# EAGLE design moisture_meter (EAGLE 6.3)
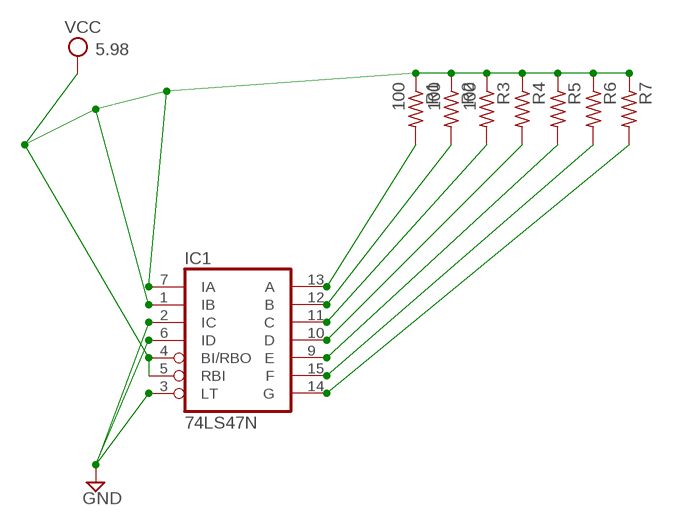
[diagram p0: schematic, sheet 1]

## Parts
IC1  74LS47N  [DIL16]
R1  100  R-US_0207/10  [0207/10]
R2  100  R-US_0207/10  [0207/10]
R3  100  R-US_0207/10  [0207/10]
R4  R-US_0207/10  [0207/10]
R5  R-US_0207/10  [0207/10]
R6  R-US_0207/10  [0207/10]
R7  R-US_0207/10  [0207/10]

## Nets
GND: IC1.2(IC) IC1.3(LT) IC1.6(ID)
N$8: IC1.13(A) R1.2
N$9: IC1.12(B) R2.2
N$10: IC1.11(C) R3.2
N$11: IC1.10(D) R4.2
N$12: IC1.9(E) R5.2
N$13: IC1.15(F) R6.2
N$14: IC1.14(G) R7.2
VCC: IC1.1(IB) IC1.4(BI/RBO) IC1.5(RBI) IC1.7(IA) R1.1 R2.1 R3.1 R4.1 R5.1 R6.1 R7.1

## Power pins joined to a net without a drawn wire
GND: IC1.8(GND)
VCC: IC1.16(VCC)

## Library data of the parts
IC1 = 74xx-eu:74*47: BCD to seven segment DECODER/DRIVER Source: http://www.ee.washington.edu/stores/DataSheets/74ls/74ls47.pdf
R1-R7 = resistor:R-US_: RESISTOR, American symbol

## Board
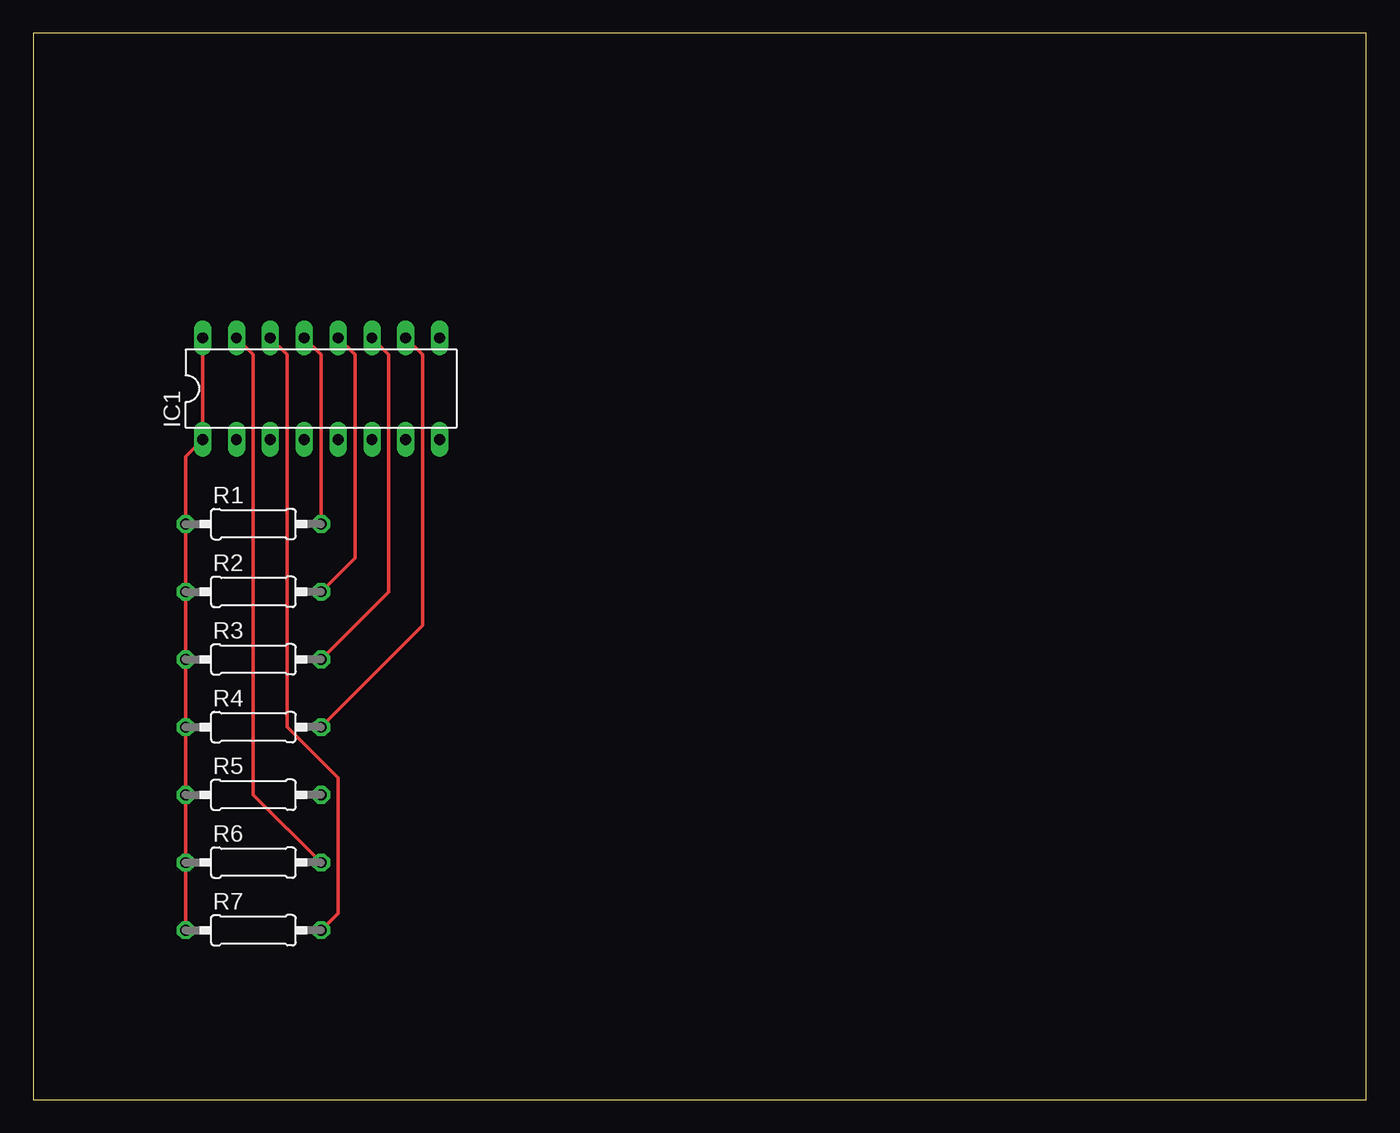
[diagram p1: board, top side]
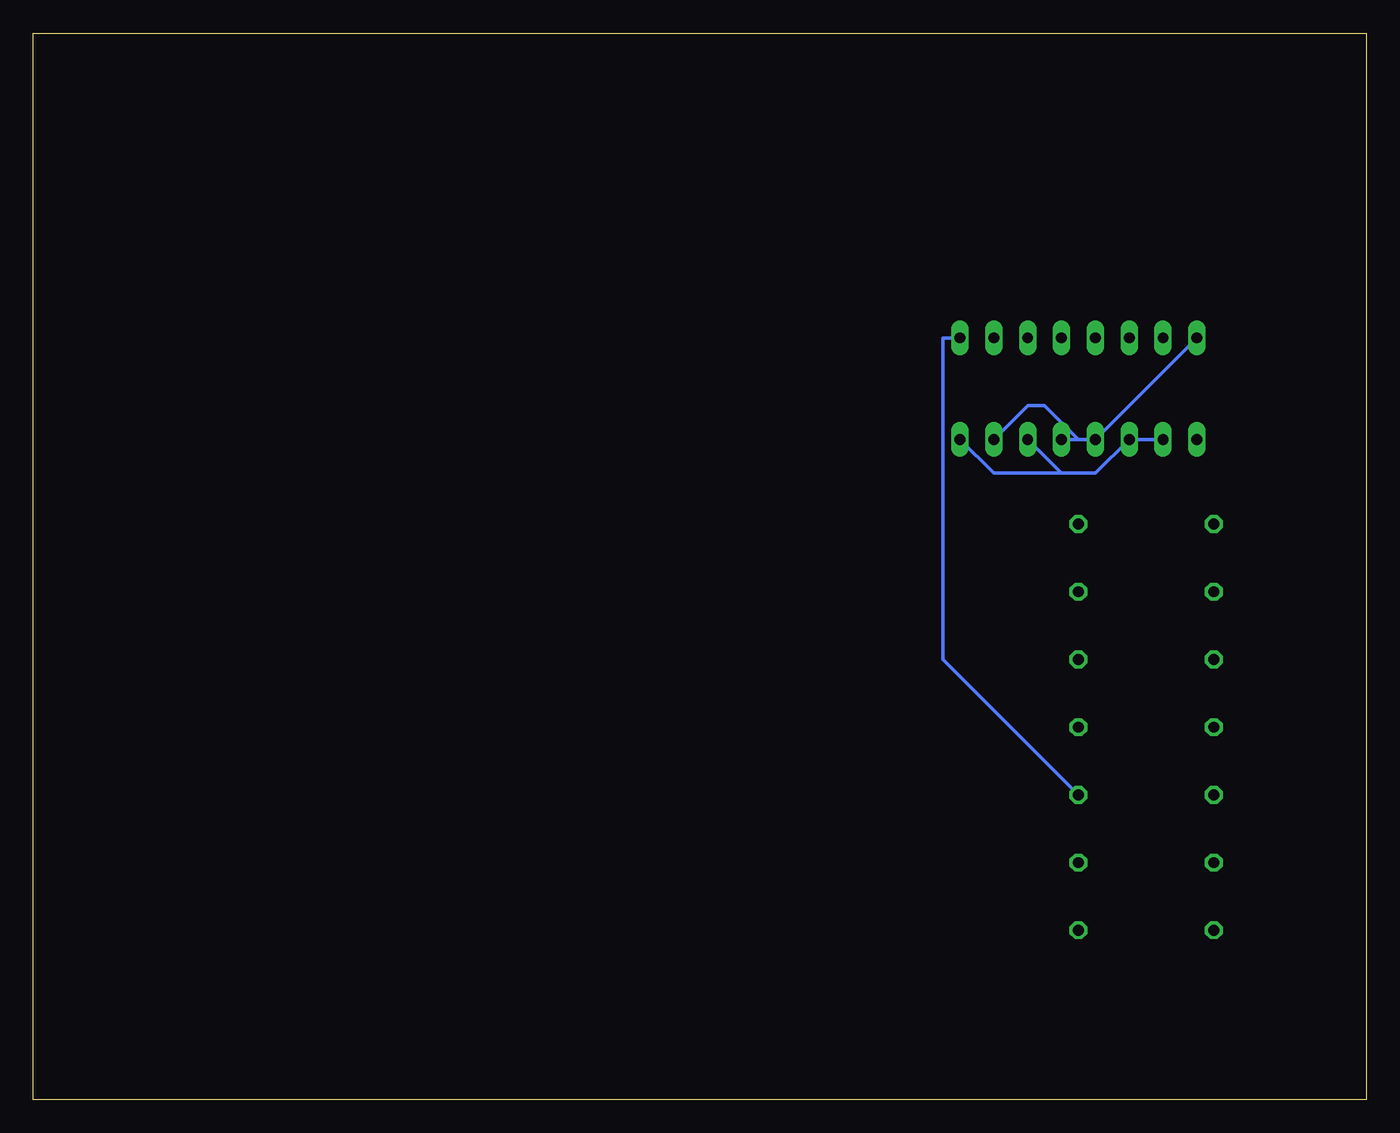
[diagram p2: board, bottom side, seen from below]

Size 100 x 80 mm. Coordinates in mm from the lower left corner, seen from the top.
Outline: 0,0 100,0 100,80 0,80 0,0
Copper layers (1*16): Top 0.035mm / dielectric 1.5mm / Bottom 0.035mm
Design rules "default": minimum track width 10mil, minimum drill 24mil, track to track 8mil, track to pad 8mil, pad to pad 8mil, via to via 8mil, smd to smd 8mil, copper to edge 40mil, drill to drill 8mil, minimum pad ring 10mil, minimum via ring 8mil, stop-mask expansion 4mil, vias tented up to drill 0mil, thermal gap 10mil

### Footprints (pad centres in the part's own frame; a part is rotated, then mirrored left to right if it is on the bottom)
DIL16 = drill 0.813 long: 1 -8.89,-3.81; 2 -6.35,-3.81; 3 -3.81,-3.81; 4 -1.27,-3.81; 5 1.27,-3.81; 6 3.81,-3.81; 7 6.35,-3.81; 8 8.89,-3.81; 9 8.89,3.81; 10 6.35,3.81; 11 3.81,3.81; 12 1.27,3.81; 13 -1.27,3.81; 14 -3.81,3.81; 15 -6.35,3.81; 16 -8.89,3.81
0207/10 = drill 0.813 octagon: 1 -5.08,0; 2 5.08,0

### Placement (x,y rotation side)
IC1  21.59,53.34 0 top
R1  16.51,43.18 0 top
R2  16.51,38.1 0 top
R3  16.51,33.02 0 top
R4  16.51,27.94 0 top
R5  16.51,22.86 0 top
R6  16.51,17.78 0 top
R7  16.51,12.7 0 top

### Tracks (layer width: path | path; a pad name or v marks a point on that pad's centre or on a via)
GND
  Bottom 0.254: IC1.2 IC1.3 20.32,46.99 22.86,46.99 | 22.86,46.99 IC1.6 | IC1.8 27.94,46.99 22.86,46.99
N$8
  Top 0.254: R1.2 21.59,55.88 IC1.13
N$9
  Top 0.254: R2.2 24.13,40.64 24.13,55.88 IC1.12
N$10
  Top 0.254: R3.2 26.67,38.1 26.67,55.88 IC1.11
N$11
  Top 0.254: R4.2 29.21,35.56 29.21,55.88 IC1.10
N$12
  Bottom 0.254: R5.2 31.75,33.02 31.75,57.15 IC1.9
N$13
  Top 0.254: R6.2 16.51,22.86 16.51,55.88 IC1.15
N$14
  Top 0.254: R7.2 22.86,13.97 22.86,24.13 19.05,27.94 19.05,55.88 IC1.14
VCC
  Top 0.254: R7.1 R6.1 R5.1 R4.1 R3.1 R2.1 R1.1 11.43,48.26 IC1.1 IC1.16
  Bottom 0.254: IC1.5 21.59,49.53 | 21.59,49.53 IC1.4 IC1.16 | IC1.7 25.4,52.07 24.13,52.07 21.59,49.53